# EAGLE design Tide_controller_shield_v1 (EAGLE 7.2.0)
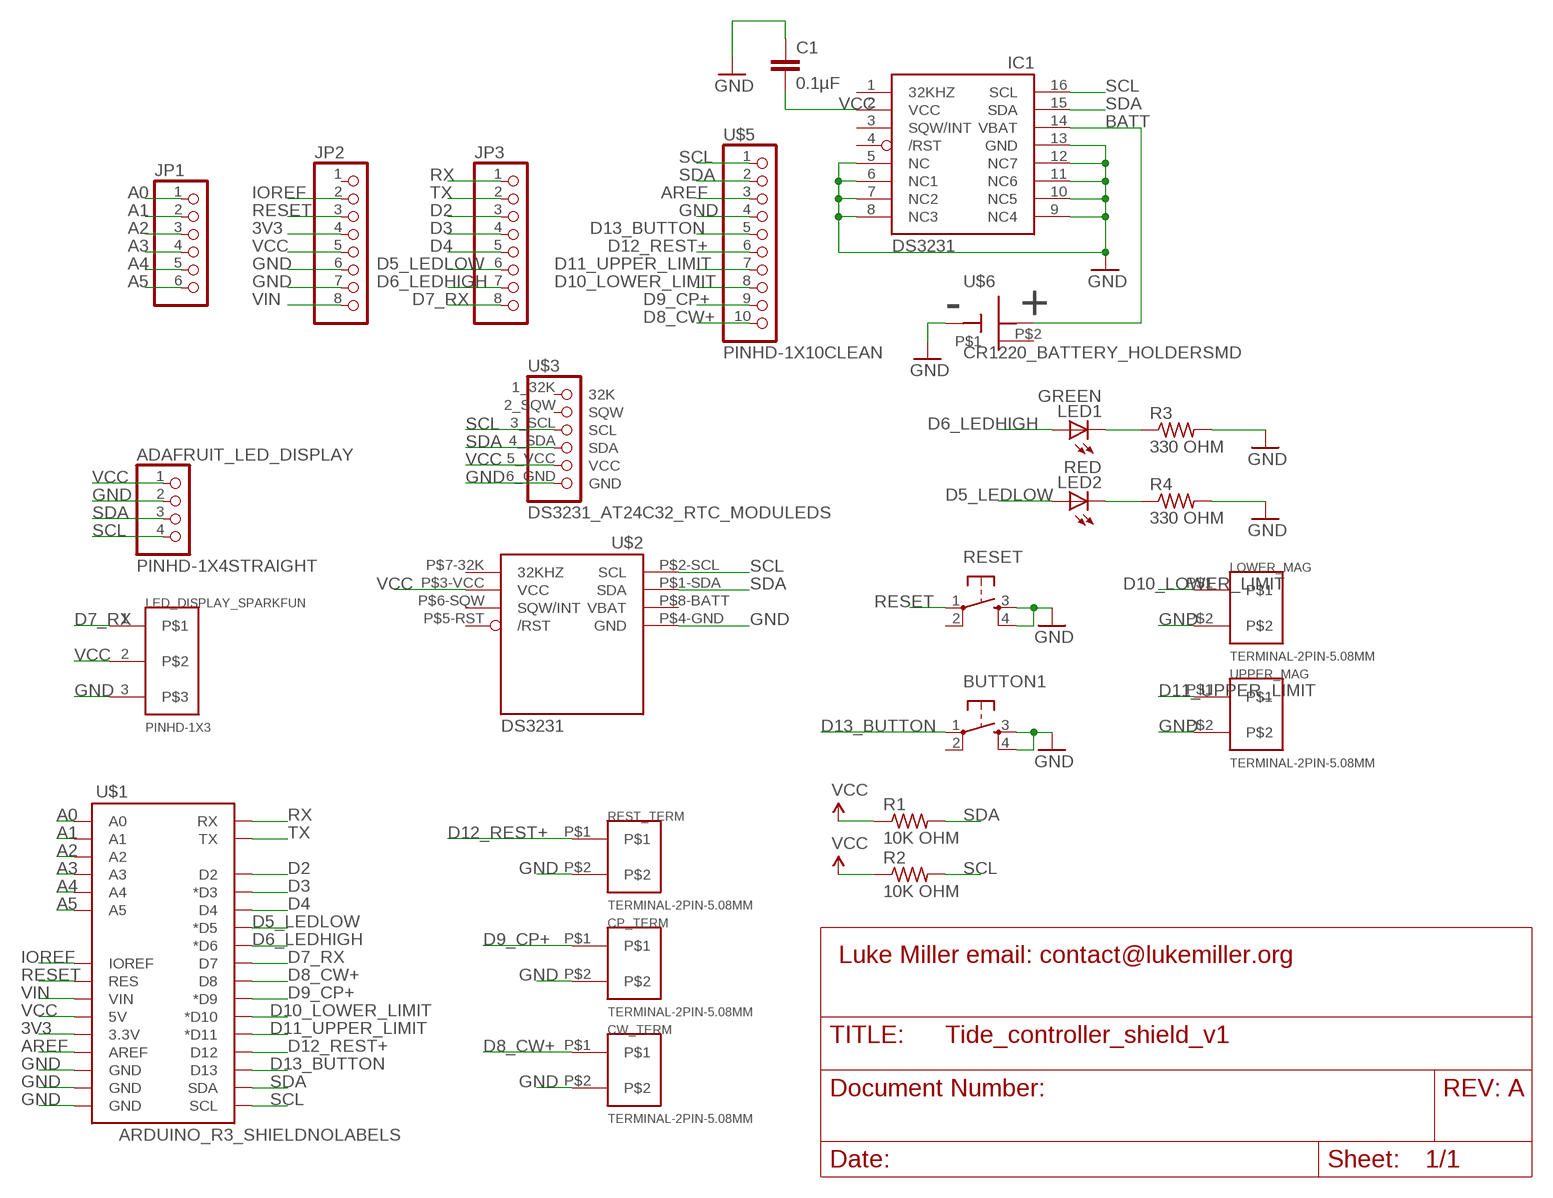
[diagram p0: schematic, sheet 1]

## Parts
ADAFRUIT_LED_DISPLAY  PINHD-1X4STRAIGHT  [1X04]
BUTTON1  PUSHBUTTON-DPST-PTH  [SWITCH-TACTILE-PTH-DPST]
C1  0.1µF  CAP0805  [0805]
CP_TERM  TERMINAL-2PIN-5.08MM  [TERMINAL-2PIN-5.08MM]
CW_TERM  TERMINAL-2PIN-5.08MM  [TERMINAL-2PIN-5.08MM]
IC1  DS3231/SO  [SO16W]
JP1  PINHD-1X6CLEAN  [1X06-CLEAN]
JP2  PINHD-1X8CLEANBIG  [1X08-CLEANBIG]
JP3  PINHD-1X8CLEANBIG  [1X08-CLEANBIG]
LED1  GREEN  LED5MM  [LED5MM]
LED2  RED  LED5MM  [LED5MM]
LED_DISPLAY_SPARKFUN  PINHD-1X3  [1X03]
LOWER_MAG  TERMINAL-2PIN-5.08MM  [TERMINAL-2PIN-5.08MM]
R1  10K OHM  RESISTOR-PTH  [0309/10]
R2  10K OHM  RESISTOR-PTH  [0309/10]
R3  330 OHM  RESISTOR-PTH  [0309/10]
R4  330 OHM  RESISTOR-PTH  [0309/10]
RESET  PUSHBUTTON-DPST-PTH  [SWITCH-TACTILE-PTH-DPST]
REST_TERM  TERMINAL-2PIN-5.08MM  [TERMINAL-2PIN-5.08MM]
U$1  ARDUINO_R3_SHIELDNOLABELS  [UNO_R3_SHIELD_NOLABELS]
U$2  CHRONODOT-OUTLINE  [CHRONODOT-OUTLINE]
U$3  DS3231_AT24C32_RTC_MODULEDS  [DS3231_AT24C32_RTC_MODULE]
U$5  PINHD-1X10CLEAN  [1X10-CLEANBIG]
U$6  CR1220_BATTERY_HOLDERSMD  [CR1220_BATTERY_HOLDER_SMD]
UPPER_MAG  TERMINAL-2PIN-5.08MM  [TERMINAL-2PIN-5.08MM]

## Nets
3V3: JP2.4 U$1.3.3V
A0: JP1.1 U$1.A0
A1: JP1.2 U$1.A1
A2: JP1.3 U$1.A2
A3: JP1.4 U$1.A3
A4: JP1.5 U$1.A4
A5: JP1.6 U$1.A5
AREF: U$1.AREF U$5.3
BATT: IC1.14(VBAT) U$6.P$1(VBAT)
D2: JP3.3 U$1.D2
D3: JP3.4 U$1.D3(*D3)
D4: JP3.5 U$1.D4
D5_LEDLOW: JP3.6 LED2.A U$1.D5(*D5)
D6_LEDHIGH: JP3.7 LED1.A U$1.D6(*D6)
D7_RX: JP3.8 LED_DISPLAY_SPARKFUN.1 U$1.D7
D8_CW+: CW_TERM.P$1 U$1.D8 U$5.10
D9_CP+: CP_TERM.P$1 U$1.D9(*D9) U$5.9
D10_LOWER_LIMIT: LOWER_MAG.P$1 U$1.D10(*D10) U$5.8
D11_UPPER_LIMIT: U$1.D11(*D11) U$5.7 UPPER_MAG.P$1
D12_REST+: REST_TERM.P$1 U$1.D12 U$5.6
D13_BUTTON: BUTTON1.1 U$1.D13 U$5.5
GND: ADAFRUIT_LED_DISPLAY.2 BUTTON1.3 BUTTON1.4 C1.1 CP_TERM.P$2 CW_TERM.P$2 IC1.5(NC) IC1.6(NC1) IC1.7(NC2) IC1.8(NC3) IC1.9(NC4) IC1.10(NC5) IC1.11(NC6) IC1.12(NC7) IC1.13(GND) JP2.6 JP2.7 LED_DISPLAY_SPARKFUN.3 LOWER_MAG.P$2 R3.2 R4.2 RESET.3 RESET.4 REST_TERM.P$2 U$1.GND@0(GND) U$1.GND@1(GND) U$1.GND@2(GND) U$2.P$4-GND(GND) U$3.6_GND(GND) U$5.4 U$6.GND UPPER_MAG.P$2
IOREF: JP2.2 U$1.IOREF
N$1: LED1.K(C) R3.1
N$2: LED2.K(C) R4.1
RESET: JP2.3 RESET.1 U$1.RES
RX: JP3.1 U$1.RX
SCL: ADAFRUIT_LED_DISPLAY.4 IC1.16(SCL) R2.2 U$1.SCL U$2.P$2-SCL(SCL) U$3.3_SCL(SCL) U$5.1
SDA: ADAFRUIT_LED_DISPLAY.3 IC1.15(SDA) R1.2 U$1.SDA U$2.P$1-SDA(SDA) U$3.4_SDA(SDA) U$5.2
TX: JP3.2 U$1.TX
VCC: ADAFRUIT_LED_DISPLAY.1 C1.2 IC1.2(VCC) JP2.5 LED_DISPLAY_SPARKFUN.2 R1.1 R2.1 U$1.5V U$2.P$3-VCC(VCC) U$3.5_VCC(VCC)
VIN: JP2.8 U$1.VIN
Unconnected: BUTTON1.2 IC1.1(32KHZ) IC1.3(SQW/INT) IC1.4(/RST) JP2.1 RESET.2 U$2.P$5-RST(/RST) U$2.P$6-SQW(SQW/INT) U$2.P$7-32K(32KHZ) U$3.1_32K(32K) U$3.2_SQW(SQW) U$6.P$2

## Power pins joined to a net without a drawn wire
VBAT: U$2.P$8-BATT(VBAT)

## Library data of the parts
ADAFRUIT_LED_DISPLAY = miller:PINHD-1X4: 1x4 0.1" space header Holes are slightly staggered to help hold pins in place when soldering.
BUTTON1 RESET = miller:PUSHBUTTON-DPST-PTH: Tactile switch - DPST, Through-hole Standard hobbyist-style switch Pins on the left edge (1,3) are connected when the button is depressed, as are the pins on the right edge (2,4). Pins 1 and 2 (top edge) are always connected, and pins on the bottom edge (3 and 4) are always connected.
C1 = miller:CAP: Capacitor Standard 0603 ceramic capacitor, and 0.1" leaded capacitor.
CP_TERM CW_TERM LOWER_MAG REST_TERM UPPER_MAG = miller:TERMINAL-2PIN-5.08MM
IC1 = miller:DS3231: DS3231 Real Time Clock, I2C. Temperature-compensated crystal oscillator 16SOIC-WIDE
JP1 = miller:PINHD-1X6: PIN HEADER
JP2 JP3 = miller:PINHD-1X8: PIN HEADER
LED1 LED2 = SparkFunEagle-6-6-07:LED: LEDs Standard schematic elements and footprints for 5mm, 3mm, 1206, and 0603 sized LEDs. 5mm - Spark Fun Electronics SKU : COM-00529 (and others)
LED_DISPLAY_SPARKFUN = miller:PINHD-1X3: 1x3 pin header, 0.1" spacing (2.54mm)
R1-R4 = miller:RESISTOR-PTH: Through-hole resistor
U$1 = miller:ARDUINO_R3_SHIELD: Shield form compatible with the Arduino Uno R3.
U$2 = miller:CHRONODOT-OUTLINE: Chronodot outline This is the footprint and outline for a Chronodot to allow easy installation on your circuit board. It assumes you are purchasing an assembled Chronodot and simply soldering it on to your board.
U$3 = miller:DS3231_AT24C32_RTC_MODULE: DS3231 Real Time Clock with AT24C32 memory module Generic DS3231 RTC boards available from Amazon/Ebay, that come with a AT24C32 memory chip added on. These typically come with a right-angle 1x6 header installed, so that the RTC board stands upright off the main PCB it is being installed onto.
U$5 = miller:PINHD-1X10: Pin header 1x10 0.1" spacing With round pins
U$6 = miller:CR1220_BATTERY_HOLDER: CR1220 Battery Holder Keystone Part # 3001 Digikey 3001K-ND

## Board
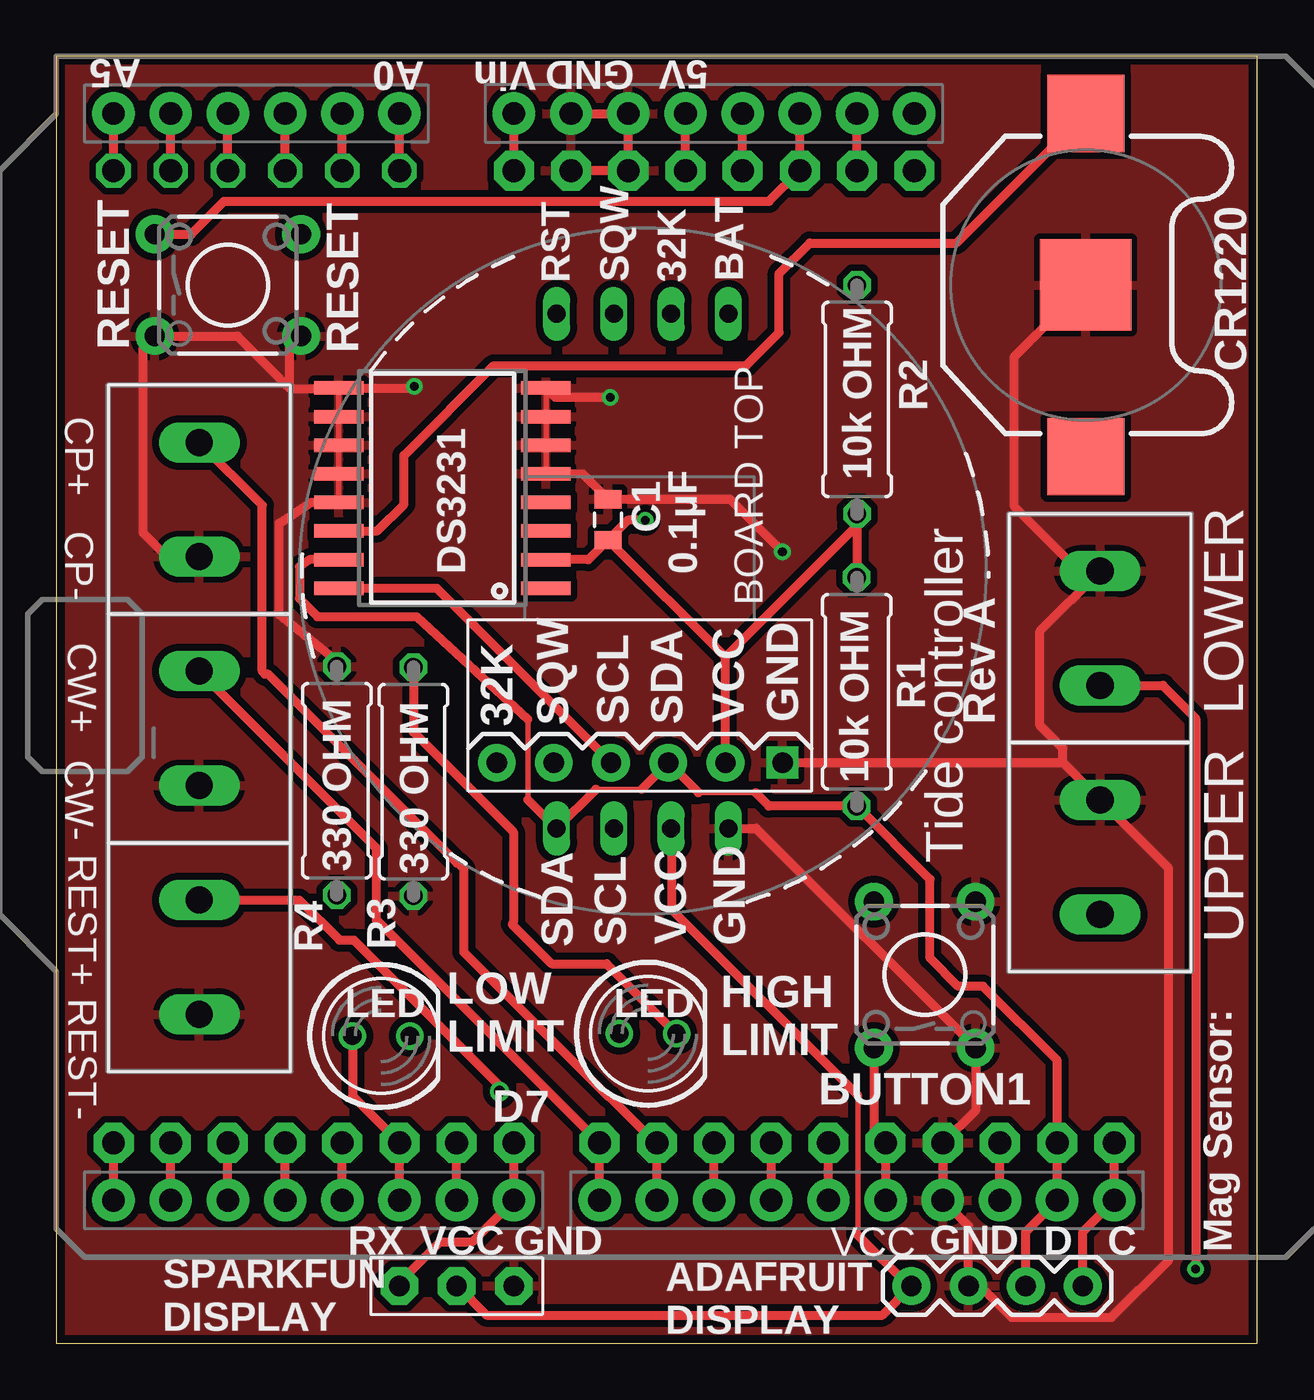
[diagram p1: board, top side]
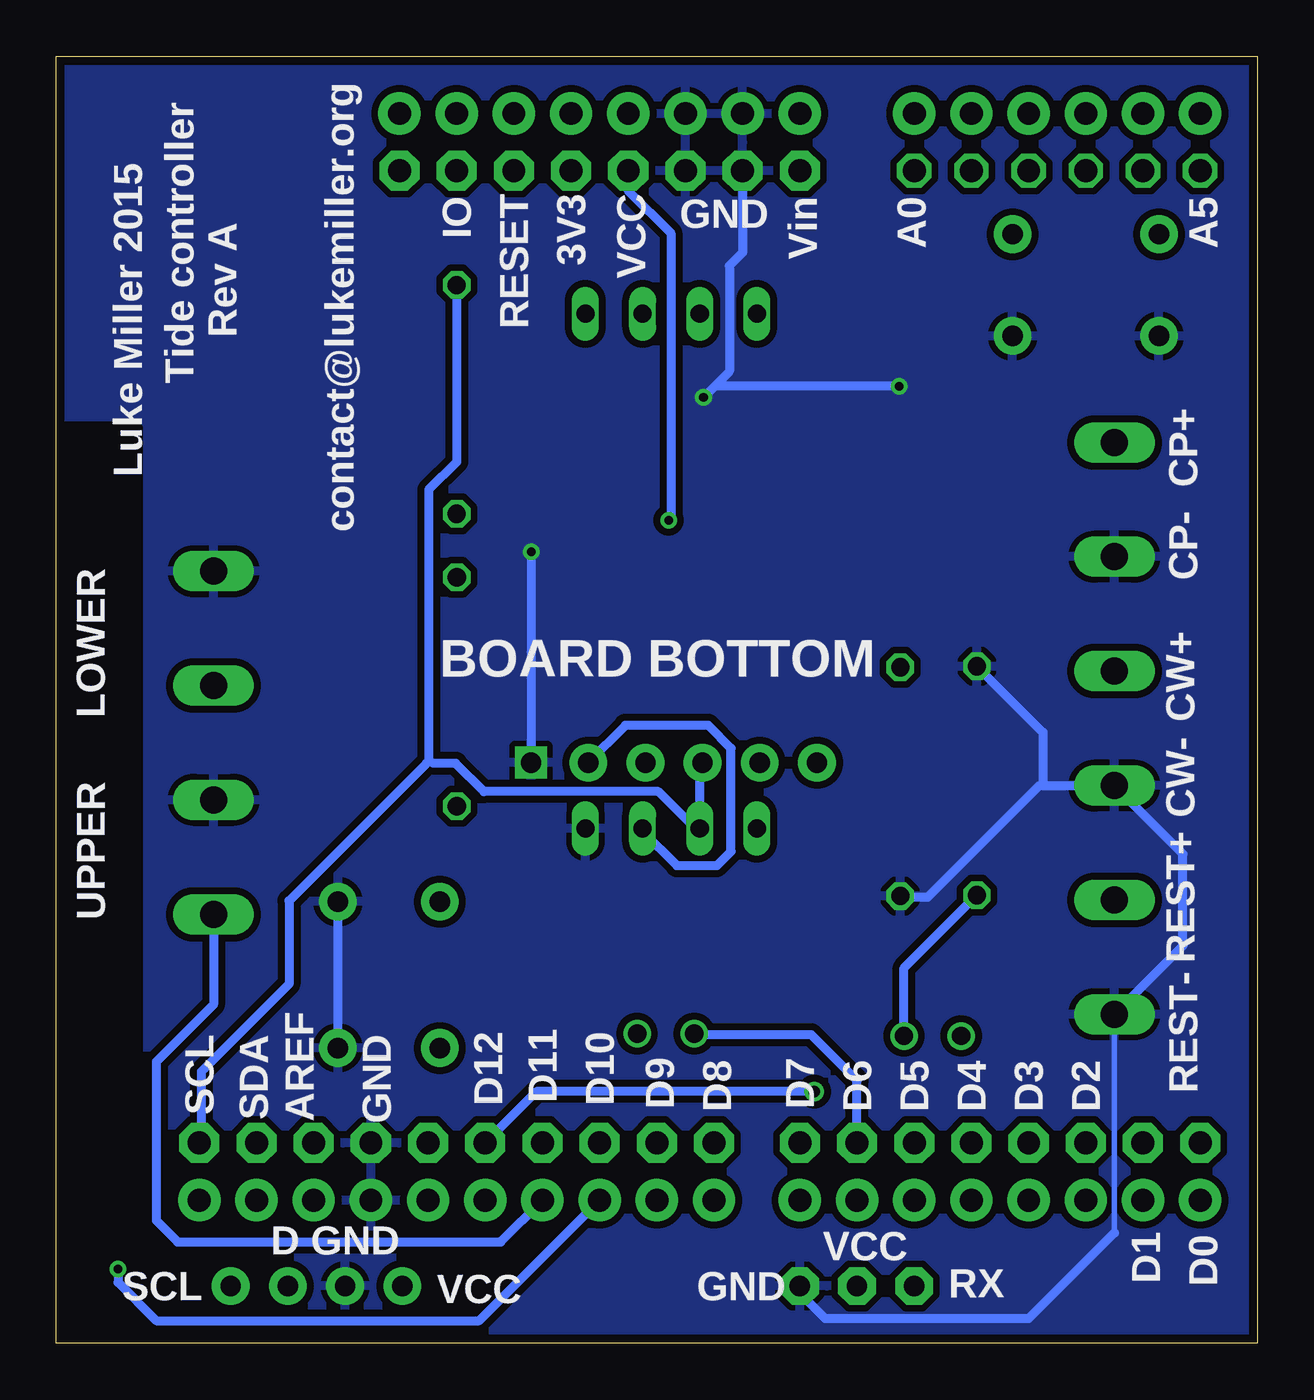
[diagram p2: board, bottom side, seen from below]

Size 53.34 x 57.15 mm. Coordinates in mm from the lower left corner, seen from the top.
Outline: 0,57.15 0,0 53.34,0 53.34,57.15 0,57.15
Copper layers (1*16): Top 0.0356mm / dielectric 1.5011mm / Bottom 0.0356mm
Design rules "LaenPCBOrder *": minimum track width 6mil, minimum drill 13mil, track to track 6mil, track to pad 6mil, pad to pad 6mil, via to via 6mil, smd to smd 6mil, copper to edge 15mil, drill to drill 6mil, minimum pad ring 7mil, minimum via ring 7mil, stop-mask expansion 3mil, vias tented up to drill 30mil, thermal gap 10mil
bRestrict: area 49.8,10.2 to 53.2,40.6; 1 lines

### Footprints (pad centres in the part's own frame; a part is rotated, then mirrored left to right if it is on the bottom)
1X04 = drill 0.9 pad 1.676: 1 0,0; 2 2.54,0; 3 5.08,0; 4 7.62,0
SWITCH-TACTILE-PTH-DPST = drill 0.9 pad 1.676: 1 -3.251,2.261; 2 3.251,2.261; 3 -3.251,-2.261; 4 3.251,-2.261
0805 = smd 0.8 x 1.2: 1 -0.9,0; 2 0.9,0
TERMINAL-2PIN-5.08MM = drill 1.2 long: P$1 0,2.54; P$2 0,-2.54
SO16W = smd 0.6 x 2.2: 1 -4.445,-4.6; 2 -3.175,-4.6; 3 -1.905,-4.6; 4 -0.635,-4.6; 5 0.635,-4.6; 6 1.905,-4.6; 7 3.175,-4.6; 8 4.445,-4.6; 9 4.445,4.6; 10 3.175,4.6; 11 1.905,4.6; 12 0.635,4.6; 13 -0.635,4.6; 14 -1.905,4.6; 15 -3.175,4.6; 16 -4.445,4.6
1X06-CLEAN = drill 1.016 octagon: 1 -6.35,0; 2 -3.81,0; 3 -1.27,0; 4 1.27,0; 5 3.81,0; 6 6.35,0
1X08-CLEANBIG = drill 1.016 pad 1.778 octagon: 1 -8.89,0; 2 -6.35,0; 3 -3.81,0; 4 -1.27,0; 5 1.27,0; 6 3.81,0; 7 6.35,0; 8 8.89,0
LED5MM = drill 0.813: A -1.27,0; K 1.27,0
1X03 = drill 0.9 pad 1.676 octagon: 1 -2.54,0; 2 0,0; 3 2.54,0
0309/10 = drill 0.813 octagon: 1 -5.08,0; 2 5.08,0
UNO_R3_SHIELD_NOLABELS = drill 1.016 pad 1.88: 3.3V 50.8,26.67; 5V 50.8,29.21; A0 50.8,41.91; A1 50.8,44.45; A2 50.8,46.99; A3 50.8,49.53; A4 50.8,52.07; A5 50.8,54.61; AREF 2.54,15.24; D2 2.54,49.53; D3 2.54,46.99; D4 2.54,44.45; D5 2.54,41.91; D6 2.54,39.37; D7 2.54,36.83; D8 2.54,33.02; D9 2.54,30.48; D10 2.54,27.94; D11 2.54,25.4; D12 2.54,22.86; D13 2.54,20.32; GND@0 50.8,31.75; GND@1 50.8,34.29; GND@2 2.54,17.78; IOREF 50.8,21.59; NC 50.8,19.05; RES 50.8,24.13; RX 2.54,54.61; SCL 2.54,10.16; SDA 2.54,12.7; TX 2.54,52.07; VIN 50.8,36.83
CHRONODOT-OUTLINE = drill 0.8 long: P$1-SDA -3.81,-11.43; P$2-SCL -1.27,-11.43; P$3-VCC 1.27,-11.43; P$4-GND 3.81,-11.43; P$5-RST -3.81,11.43; P$6-SQW -1.27,11.43; P$7-32K 1.27,11.43; P$8-BATT 3.81,11.43
DS3231_AT24C32_RTC_MODULE = drill 0.9 pad 1.676: 1_32K -5.08,0; 2_SQW -2.54,0; 3_SCL 0,0; 4_SDA 2.54,0; 5_VCC 5.08,0 | drill 0.9 pad 1.422 square: 6_GND 7.62,0
1X10-CLEANBIG = drill 1.016 pad 1.778 octagon: 1 -11.43,0; 2 -8.89,0; 3 -6.35,0; 4 -3.81,0; 5 -1.27,0; 6 1.27,0; 7 3.81,0; 8 6.35,0; 9 8.89,0; 10 11.43,0
CR1220_BATTERY_HOLDER_SMD = smd 4.064 x 4.064: GND 0,0 | smd 3.429 x 3.429: P$1 -7.62,0; P$2 7.62,0

### Placement (x,y rotation side)
ADAFRUIT_LED_DISPLAY  37.97,2.54 0 top
BUTTON1  38.57,16.36 90 top
C1  24.51,36.58 270 top
CP_TERM  6.35,37.47 0 top
CW_TERM  6.35,27.3 0 top
IC1  17.14,37.97 90 top
JP1  8.89,52.07 180 top
JP2  29.21,52.07 180 top
JP3  11.43,8.89 0 top
LED1  26.27,13.75 0 top
LED2  14.43,13.65 0 top
LED_DISPLAY_SPARKFUN  17.78,2.54 0 top
LOWER_MAG  46.35,31.75 180 top
R1  35.55,28.93 270 top
R2  35.56,41.91 90 top
R3  15.86,24.94 270 top
R4  12.46,24.98 90 top
RESET  7.62,46.99 0 top
REST_TERM  6.35,17.14 0 top
U$1  57.15,3.81 90 top
U$2  26.04,34.29 0 top
U$3  24.64,25.78 0 top
U$5  35.56,8.89 180 top
U$6  45.72,46.99 270 top
UPPER_MAG  46.35,21.59 180 top

### Tracks (layer width: path | path; a pad name or v marks a point on that pad's centre or on a via)
3V3
  Top 0.406: JP2.4 U$1.3.3V
A0
  Top 0.406: JP1.1 U$1.A0
A1
  Top 0.406: JP1.2 U$1.A1
A2
  Top 0.406: JP1.3 U$1.A2
A3
  Top 0.406: JP1.4 U$1.A3
A4
  Top 0.406: JP1.5 U$1.A4
A5
  Top 0.406: JP1.6 U$1.A5
AREF
  Top 0.406: U$1.AREF U$5.3
BATT
  Top 0.406: IC1.14 14.26,36.07 15.44,37.25 15.44,39.42 19.43,43.41 30.63,43.41 32.1,44.88 32.1,47.5 33.46,48.86 39.97,48.86 U$6.P$1
D2
  Top 0.406: U$1.D2 JP3.3
D3
  Top 0.406: U$1.D3 JP3.4
D4
  Top 0.406: U$1.D4 JP3.5
D5_LEDLOW
  Top 0.406: LED2.A 13.15,10.97 JP3.6 U$1.D5
D6_LEDHIGH
  Top 0.406: U$1.D6 JP3.7
  Bottom 0.254: 24.96,13.7 LED1.A
  Bottom 0.406: JP3.7 17.78,11.67 19.81,13.7 24.96,13.7
D7_RX
  Top 0.406: LED_DISPLAY_SPARKFUN.1 15.24,2.7 17.05,4.51 18.48,4.51 U$1.D7 JP3.8
D8_CW+
  Top 0.406: U$1.D8 U$5.10 14.22,18.8 14.22,21.97 CW_TERM.P$1
D9_CP+
  Top 0.254: U$5.9 26.62,8.89 | 24.57,10.94 24.52,10.94
  Top 0.406: 26.62,8.89 24.57,10.94 | 24.52,10.94 18.1,17.36 18.1,21.07 17.85,21.32 17.8,21.32 9.4,29.72 9.27,29.72 9.14,29.84 9.14,37.21 CP_TERM.P$1 | U$1.D9 U$5.9
D10_LOWER_LIMIT  (via drill 0.38 pad 0.3)
  Top 0.406: LOWER_MAG.P$1 49.14,29.21 50.6,27.75 v50.6,3.3 | U$1.D10 U$5.8
  Bottom 0.406: v50.6,3.3 50.6,2.7 48.9,1 34.56,1 U$1.D10
D11_UPPER_LIMIT
  Top 0.406: U$1.D11 U$5.7
  Bottom 0.406: UPPER_MAG.P$1 46.35,15.04 48.9,12.5 48.9,5.45 47.95,4.5 33.6,4.5 U$1.D11
D12_REST+  (via drill 0.51)
  Top 0.406: U$1.D12 U$5.6 | REST_TERM.P$1 10.79,19.68 12.57,17.91 13.21,17.91 19.68,11.43 v19.68,11.18
  Bottom 0.406: v19.68,11.18 32,11.18 U$5.6
D13_BUTTON
  Top 0.406: BUTTON1.1 36.31,9.41 U$5.5 U$1.D13
GND  (via drill 0.38 pad 0.3)
  Top 0.254: 12.53,42.4 IC1.9 IC1.10 IC1.11 IC1.12 IC1.13 11.35,37.35 | IC1.5 IC1.6 IC1.7 IC1.8 | 15.82,42.42 v15.9,42.5
  Top 0.406: IC1.5 23.38,38.61 C1.1 29.92,37.48 v32.25,35.15 | 10.37,42.4 8.04,44.73 RESET.3 3.86,44.22 3.86,35.97 4.91,34.92 CP_TERM.P$2 | 10.37,42.4 12.53,42.4 | R4.2 12.46,30.29 9.89,32.35 9.89,36.4 11.35,37.35 | U$3.6_GND 44.7,25.78 | 44.7,25.78 UPPER_MAG.P$2 | UPPER_MAG.P$2 46.68,24.13 | U$6.GND 42.55,43.82 42.55,37.15 45.41,34.29 LOWER_MAG.P$2 43.69,31.62 43.69,27.43 44.7,26.42 44.7,25.78 | v24.6,42 22.16,42 IC1.8 | IC1.9 15.82,42.42 | U$2.P$4-GND 31.08,22.86 BUTTON1.3 40.83,10.35 U$5.4 U$1.GND@2 40.51,5.21 ADAFRUIT_LED_DISPLAY.2 41.02,2.54 42.42,1.14 46.86,1.14 49.4,3.68 49.4,21.08 UPPER_MAG.P$2 | U$1.GND@1 U$1.GND@0 JP2.6 JP2.7 | 10.37,42.4 10.37,44.23 RESET.4
  Bottom 0.254: U$3.6_GND | 24.1,42.5 v24.6,42 | 6.35,4.9 REST_TERM.P$2
  Bottom 0.406: JP2.7 22.86,48.44 23.45,47.85 23.45,43.15 v24.6,42 | v32.25,35.15 U$3.6_GND | v15.9,42.5 24.1,42.5 | LED_DISPLAY_SPARKFUN.3 20.32,2.22 19.2,1.1 10.15,1.1 6.35,4.9 | R3.2 15.79,19.8 14.65,19.8 9.69,24.77 9.53,24.77 | BUTTON1.3 BUTTON1.4 | REST_TERM.P$2 3.3,17.65 3.3,21.72 CW_TERM.P$2 9.53,24.77 | R4.2 9.53,27.12 9.53,24.77
  pour Bottom (isolate 0.305): 0,57.15 0,0 53.34,0 53.34,57.15
  pour Top (isolate 0.305): 0,57.15 0,0 53.34,0 53.34,57.15
IOREF
  Top 0.406: JP2.2 U$1.IOREF
N$1
  Top 0.254: 20.3,18.7 20.25,18.65 20.25,18.6
  Top 0.406: R3.1 15.86,27.14 20.3,22.7 20.3,18.7 | 20.25,18.6 22,16.85 24.44,16.85 LED1.K
N$2
  Bottom 0.406: LED2.K 15.7,16.66 R4.1
RESET
  Top 0.406: RESET.1 5.99,49.25 7.45,50.71 31.66,50.71 JP2.3 U$1.RES
RX
  Top 0.406: U$1.RX JP3.1
SCL
  Top 0.406: ADAFRUIT_LED_DISPLAY.4 45.59,4.95 U$1.SCL U$5.1 | IC1.16 16.89,33.53 U$3.3_SCL
  Bottom 0.254: 24.77,25.65 U$3.3_SCL | U$2.P$2-SCL 24.96,22.86 | 36.9,25.75 36.6,25.75 36.8,25.95 | 46.9,8.98 U$5.1
  Bottom 0.406: U$2.P$2-SCL 24.77,25.65 | 24.96,22.86 26.6,24.5 34.35,24.5 35.6,25.75 36.6,25.75 | 36.9,25.75 43,19.65 43,15.95 46.9,12.05 46.9,8.98 | R2.2 35.56,39.14 36.8,37.9 36.8,25.95
SDA
  Top 0.254: 31.05,24.45 28.51,24.45 | U$3.4_SDA | 26,24.6 23.96,24.6 | 20.95,27.7 20.95,24.14
  Top 0.406: ADAFRUIT_LED_DISPLAY.3 43.05,4.95 U$1.SDA U$5.2 44.45,12.55 41.15,15.85 40.05,15.85 38.8,17.1 38.8,20.6 R1.2 31.65,23.85 31.05,24.45 | 28.51,24.45 U$3.4_SDA | U$3.4_SDA 26,24.6 | 23.96,24.6 U$2.P$1-SDA 20.95,24.14 | IC1.15 11.25,34.8 10.8,34.47 10.8,33.07 11.6,32.27 16,32.27 20.95,27.7
TX
  Top 0.406: U$1.TX JP3.2
VCC  (via drill 0.38 pad 0.3)
  Top 0.254: 35.56,34.02 R1.1 | 35.6,4.8 35.6,11 | 27.35,22.82 U$2.P$3-VCC | LED_DISPLAY_SPARKFUN.2 17.81,2.54
  Top 0.406: C1.2 23.63,34.8 IC1.2 | U$3.5_VCC 29.72,30.47 | 29.72,30.47 C1.2 | R2.1 35.56,36.31 | 35.56,36.31 29.72,30.47 | 35.56,36.31 35.56,34.02 | 35.6,4.8 37.86,2.54 ADAFRUIT_LED_DISPLAY.1 36.68,1.25 19.1,1.25 17.81,2.54 | 35.6,11 27.35,19.25 27.35,22.82 | v26.15,36.55 25.39,36.55 C1.2 | JP2.5 U$1.5V
  Bottom 0.254: 26.05,36.65 v26.15,36.55 | U$2.P$3-VCC 27.3,22.73
  Bottom 0.406: JP2.5 27.94,51.19 26.05,49.3 26.05,36.65 | 27.3,22.73 25.78,21.21 24,21.21 23.37,21.84 23.37,26.42 24.38,27.43 28.07,27.43 U$3.5_VCC
VIN
  Top 0.406: JP2.8 U$1.VIN

### Text on the board
tPlace: A5 | A0 | Vin | GND | 5V | RST | SQW | 32K | BAT | RESET | RESET | CR1220 | CP+ | 10k OHM | CP- | 0.1µF | BOARD TOP | Rev A | CW+ | SCL | SDA | VCC | GND | LOWER | 32K | SQW | CW- | 10k OHM | REST+ | 330 OHM | 330 OHM | Tide controller | SDA | SCL | VCC | GND | UPPER | REST- | LED | LED | LOW / LIMIT | HIGH / LIMIT | BUTTON1 | D7 | RX | VCC | GND | VCC | GND | D | C | Mag Sensor: | SPARKFUN / DISPLAY | ADAFRUIT / DISPLAY
bPlace: contact@lukemiller.org | Tide controller | A5 | A0 | Vin | VCC | 3V3 | RESET | IO | GND | Rev A | CP+ | Luke Miller 2015 | CP- | LOWER | CW+ | BOARD BOTTOM | CW- | REST+ | UPPER | REST- | AREF | D10 | D11 | D12 | GND | SDA | SCL | D2 | D3 | D4 | D5 | D6 | D7 | D8 | D9 | D0 | D1 | VCC | GND | D | RX | GND | VCC | SCL
tNames: DS3231